# Altium schematic sheet Level_Shifter.SchDoc
size A
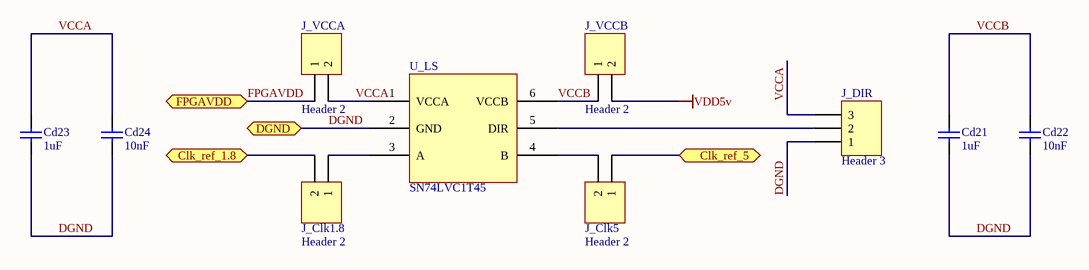
[diagram p0: Level_Shifter.SchDoc]

## Parts
Cd21  value 1uF  [1608[0603]]  (hidden comment: Cap)
Cd22  value 10nF  [1608[0603]]  (hidden comment: Cap)
Cd23  value 1uF  [1608[0603]]  (hidden comment: Cap)
Cd24  value 10nF  [1608[0603]]  (hidden comment: Cap)
J_Clk1.8  Header 2  [HDR1X2]
J_Clk5  Header 2  [HDR1X2]
J_DIR  Header 3  [HDR1X3]
J_VCCA  Header 2  [HDR1X2]
J_VCCB  Header 2  [HDR1X2]
U_LS  SN74LVC1T45  [SO-G6/P.95]

## Ports
Clk_ref_1.8 (bidir), Clk_ref_5 (bidir), DGND (bidir), FPGAVDD (bidir)

## Nets
VDD5v: J_VCCB.2
Clk_ref_1.8: J_Clk1.8.2 ; port Clk_ref_1.8
Clk_ref_5: J_Clk5.1 ; port Clk_ref_5
DGND: Cd21.2 Cd22.2 Cd23.2 Cd24.2 J_DIR.1 U_LS.2(GND) ; port DGND
FPGAVDD: J_VCCA.1 ; port FPGAVDD
VCCA: Cd23.1 Cd24.1 J_DIR.3 J_VCCA.2 U_LS.1(VCCA)
VCCB: Cd21.1 Cd22.1 J_VCCB.1 U_LS.6(VCCB)
NetJ_Clk1.8_1: J_Clk1.8.1 U_LS.3(A)
NetJ_Clk5_2: J_Clk5.2 U_LS.4(B)
NetJ_DIR_2: J_DIR.2 U_LS.5(DIR)

## Library data of the parts
Cd21-Cd24 = Cap: Capacitor; Published: 8-Jun-2000; LatestRevisionDate: 17-Jul-2002; LatestRevisionNote: Re-released for DXP Platform.; PackageReference: RAD-0.3; Publisher: Altium Limited; PackageDescription: Radial Cap, Thru-Hole; 2 Leads; 0.3 in Pin Spacing; Digi-Key: 445-7534-1-ND
J_Clk1.8 J_Clk5 J_VCCA J_VCCB = Header 2: Header, 2-Pin; LatestRevisionDate: 17-Jul-2002; LatestRevisionNote: Re-released for DXP Platform.; Publisher: Altium Limited
J_DIR = Header 3: Header, 3-Pin; LatestRevisionDate: 17-Jul-2002; LatestRevisionNote: Re-released for DXP Platform.; Publisher: Altium Limited